# Altium project Kocka_V2.0_ARM.PrjPcb
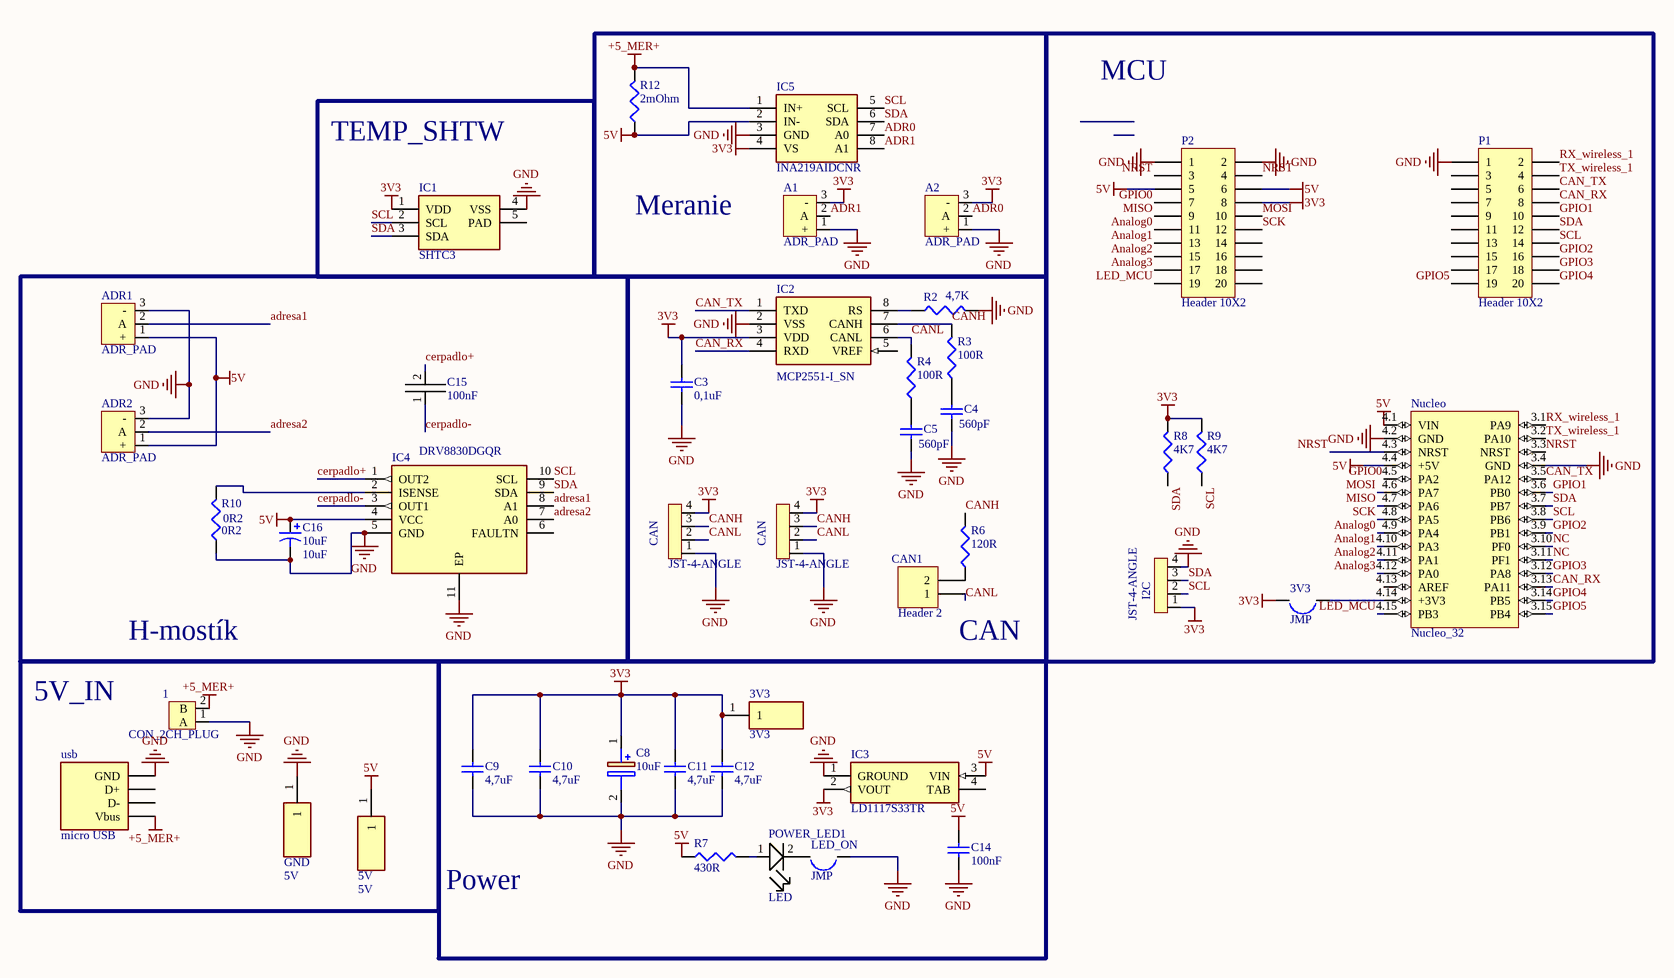
[diagram p0: Sheet_Kocka_V2.0_ARM.SchDoc]
1 sheet, 44 parts. Net scope: global (net labels, ports and power ports of the same name join across sheets).
Board files: PCB_Kocka_V2.0_ARM.PcbDoc, PCB_Kocka_panel_ARM.PcbDoc

## Sheet Sheet_Kocka_V2.0_ARM.SchDoc
size A0

### Parts
(Parts that share a designator on the sheet are numbered #1, #2 ... from top to bottom, then left to right.)
1  CON_2CH_PLUG  [CON_2CH_PLUG]
3V3#1  JMP  [JMP]
3V3#2  3V3  [1508000150000030]
5V  5V  [1508000150000030]
A1  ADR_PAD  [SOLDER_PAD]
A2  ADR_PAD  [SOLDER_PAD]
ADR1  ADR_PAD  [SOLDER_PAD]
ADR2  ADR_PAD  [SOLDER_PAD]
C3  0,1uF  [1608[0603]]
C4  560pF  [1608[0603]]
C5  560pF  [1608[0603]]
C8  10uF  [CAPPM3216X180N]
C9  4,7uF  [1608[0603]]
C10  4,7uF  [1608[0603]]
C11  4,7uF  [1608[0603]]
C12  4,7uF  [1608[0603]]
C14  100nF  [1608[0603]]
C15  100nF  [Capacitor]
C16  10uF  [C0805]
CAN1  Header 2  [HDR1X2]
CAN#1  JST-4-ANGLE  [JST-4-ANGLE]
CAN#2  JST-4-ANGLE  [JST-4-ANGLE]
GND  5V  [1508000150000030]
I2C  JST-4-ANGLE  [JST-4-ANGLE]
IC1  SHTC3  [SHTC3]
IC2  MCP2551-I_SN  [SOIC127P600X175-8N]
IC3  LD1117S33TR  [SOT230P700X180-4N]
IC4  DRV8830DGQR  [SOP50P490X110-11N]
IC5  INA219AIDCNR  [SOT65P280X145-8N]
LED_ON  JMP  [JMP]
Nucleo  Nucleo_32  [Nucleo_32]
P1  Header 10X2  [HDR2X10]
P2  Header 10X2  [HDR2X10]
POWER_LED1  LED  [LED5mA]
R2  4,7K  [J1-0603]
R3  100R  [J1-0603]
R4  100R  [J1-0603]
R6  120R  [J1-0603]
R7  430R  [J1-0603]
R8  4K7  [J1-0603]
R9  4K7  [J1-0603]
R10  0R2  [J1-0603]
R12  2mOhm  [RESC3216X75N]
usb  micro USB  [micro USB]

### Blocks framed on the sheet
Meranie: A1 A2 IC5 R12
MCU: 3V3#1 I2C Nucleo P1 P2 R8 R9
TEMP_SHTW: IC1
H-mostík: ADR1 ADR2 C15 C16 IC4 R10
CAN: C3-C5 CAN1 CAN#1 CAN#2 IC2 R2-R4 R6
Power: 3V3#2 C8-C12 C14 IC3 LED_ON POWER_LED1 R7

### Nets
3V3: 3V3#1.2 3V3#2.1 A1.3(-) A2.3(-) C3.1 C8.1(+) C9.1 C10.1 C11.1 C12.1 CAN#1.4 CAN#2.4 I2C.1 IC1.1(VDD) IC2.3(VDD) IC3.2(VOUT) IC5.4(VS) P2.8 R8.2 R9.2
5V: 5V.1 ADR1.1(+) ADR2.1(+) C14.1 C16.1 IC3.3(VIN) IC4.4(VCC) IC5.2(IN-) Nucleo.4.1(VIN) Nucleo.4.4(+5V) P2.5 P2.6 R7.1 R12.1
+5_MER+: 1.2(B) IC5.1(IN+) R12.2 usb.1(Vbus)
GND: 1.1(A) A1.1(+) A2.1(+) ADR1.3(-) ADR2.3(-) C3.2 C4.2 C5.2 C8.2(-) C9.2 C10.2 C11.2 C12.2 C14.2 C16.2 CAN#1.1 CAN#2.1 GND.1 I2C.4 IC1.4(VSS) IC2.2(VSS) IC3.1(GROUND) IC4.5(GND) IC4.11(EP) IC5.3(GND) LED_ON.1 Nucleo.3.4(GND) Nucleo.4.2(GND) P1.1 P2.1 P2.2 R2.2 R10.1 usb.5(GND)
ADR0: A2.2(A) IC5.7(A0)
ADR1: A1.2(A) IC5.8(A1)
adresa1: ADR1.2(A) IC4.8(A1)
adresa2: ADR2.2(A) IC4.7(A0)
Analog0: Nucleo.4.9(PA4) P2.11
Analog1: Nucleo.4.10(PA3) P2.13
Analog2: Nucleo.4.11(PA1) P2.15
Analog3: Nucleo.4.12(PA0) P2.17
CAN_RX: IC2.4(RXD) Nucleo.3.13(PA11) P1.8
CAN_TX: IC2.1(TXD) Nucleo.3.5(PA12) P1.6
CANH: CAN#1.3 CAN#2.3 IC2.7(CANH) R3.2 R6.2
CANL: CAN1.1 CAN#1.2 CAN#2.2 IC2.6(CANL) R4.2
cerpadlo+: C15.2 IC4.1(OUT2)
cerpadlo-: C15.1 IC4.3(OUT1)
GPIO0: Nucleo.4.5(PA2) P2.7
GPIO1: Nucleo.3.6(PB0) P1.10
GPIO2: Nucleo.3.9(PB1) P1.16
GPIO3: Nucleo.3.12(PA8) P1.18
GPIO4: Nucleo.3.14(PB5) P1.20
GPIO5: Nucleo.3.15(PB4) P1.19
LED_MCU: Nucleo.4.15(PB3) P2.19
MISO: Nucleo.4.7(PA6) P2.9
MOSI: Nucleo.4.6(PA7) P2.10
NC: Nucleo.3.10(PF0) Nucleo.3.11(PF1)
NRST: Nucleo.3.3(NRST) Nucleo.4.3(NRST) P2.3 P2.4
RX_wireless_1: Nucleo.3.1(PA9) P1.2
SCK: Nucleo.4.8(PA5) P2.12
SCL: I2C.2 IC1.2(SCL) IC4.10(SCL) IC5.5(SCL) Nucleo.3.8(PB6) P1.14 R9.1
SDA: I2C.3 IC1.3(SDA) IC4.9(SDA) IC5.6(SDA) Nucleo.3.7(PB7) P1.12 R8.1
TX_wireless_1: Nucleo.3.2(PA10) P1.4
Net3V3#1_1: 3V3#1.1 Nucleo.4.14(+3V3)
NetC4_1: C4.1 R3.1
NetC5_1: C5.1 R4.1
NetCAN1_2: CAN1.2 R6.1
NetIC2_8: IC2.8(RS) R2.1
NetIC4_2: IC4.2(ISENSE) R10.2
NetLED_ON_2: LED_ON.2 POWER_LED1.2
NetPOWER_LED1_1: POWER_LED1.1 R7.2

Not connected (* = marked no-connect by the designer): IC1 5(PAD); IC2 5(VREF); IC3 4(TAB); IC4 6(FAULTN); Nucleo 4.13(AREF); P1 3 5 7 9 11 13 15 17; P2 14 16 18 20; usb 2(D-) 3(D+)

### Notes on the sheet
- 5V_IN

### Library data of the parts
1 = CON_2CH_PLUG: TBG-5.0-KW-2P
3V3#2 5V GND = 5015: Undefined or Miscellaneous; Manufacturer_Name: Keystone Electronics; Allied_Number: 70182998; Datasheet Link: http://www.keyelco.com/product-pdf.cfm?p=1353; Height: 1.52mm; Manufacturer_Part_Number: 5015; Mouser Part Number: 534-5015; Mouser Price/Stock: https://www.mouser.com/Search/Refine.aspx?Keyword=534-5015; Allied Price/Stock: https://www.alliedelec.com/keystone-electronics-5015/70182998/
A1 A2 ADR1 ADR2 = ADR_PAD: ADR PAD 3 PIN
C3-C5 = Cap Semi: Capacitor (Semiconductor SIM Model); Value: 100pF; Published: 8-Jun-2000; LatestRevisionDate: 29-May-2009; LatestRevisionNote: IPC-7351 Footprint Added.; PackageReference: C1206; Publisher: Altium Limited; PackageDescription: Chip Capacitor
C8 = TAJA106K004RNJ: Capacitor Polarised; Manufacturer_Name: AVX; Datasheet Link: http://www.farnell.com/datasheets/1680476.pdf; Height: 1.8mm; Manufacturer_Part_Number: TAJA106K004RNJ; Mouser Part Number: 581-TAJA106K004R; Mouser Price/Stock: https://www.mouser.com/Search/Refine.aspx?Keyword=581-TAJA106K004R
C9-C12 C14 = Cap Semi: Capacitor; Value: 100pF; Published: 8-Jun-2000; LatestRevisionDate: 29-May-2009; LatestRevisionNote: IPC-7351 Footprint Added.; PackageReference: C1206; Publisher: Altium Limited; PackageDescription: Chip Capacitor
C15 = Cap
C16 = Cap Pol3: Polarized Capacitor (Surface Mount); Published: 8-Jun-2000; LatestRevisionDate: 29-May-2009; LatestRevisionNote: IPC-7351 Footprint Added.; PackageReference: C0805; Publisher: Altium Limited; PackageDescription: Chip Capacitor; Value: 10uF
CAN1 = Header 2: Header, 2-Pin; LatestRevisionDate: 17-Jul-2002; LatestRevisionNote: Re-released for DXP Platform.; Publisher: Altium Limited
CAN#1 CAN#2 I2C = JST-4-ANGLE: NXW-04K
IC1 = SHTC3: Integrated Circuit; Manufacturer_Name: Sensirion; Datasheet Link: https://www.glynshop.com/erp/owweb/Daten/Datenblaetter/Sensirion/SHTC3.pdf; Height: 0mm; Manufacturer_Part_Number: SHTC3; Mouser Part Number: 403-SHTC3; Mouser Price/Stock: https://www.mouser.com/Search/Refine.aspx?Keyword=403-SHTC3
IC2 = MCP2551-I_SN: Integrated Circuit; Manufacturer_Name: Microchip; Manufacturer_Part_Number: MCP2551-I/SN; Allied_Number: 70045403; Datasheet Link: http://docs-emea.rs-online.com/webdocs/0a78/0900766b80a78cdb.pdf; Height: 1.75mm; Mouser Part Number: 579-MCP2551-I/SN; Mouser Price/Stock: https://www.mouser.com/Search/Refine.aspx?Keyword=579-MCP2551-I%2FSN; RS Part Number: 0402904P; RS Price/Stock: http://uk.rs-online.com/web/p/products/0402904P; Allied Price/Stock: http://www.alliedelec.com/microchip-technology-inc-mcp2551-i-sn/70045403/
IC3 = LD1117S33TR: Integrated Circuit; Manufacturer_Name: STMicroelectronics; Allied_Number: 70390201; Datasheet Link: http://www.st.com/st-web-ui/static/active/en/resource/technical/document/datasheet/CD00000544.pdf; Height: 1.8mm; Manufacturer_Part_Number: LD1117S33TR; Mouser Part Number: 511-LD1117S33; Mouser Price/Stock: https://www.mouser.com/Search/Refine.aspx?Keyword=511-LD1117S33; RS Part Number: 7140697P; RS Price/Stock: http://uk.rs-online.com/web/p/products/7140697P; Allied Price/Stock: http://www.alliedelec.com/stmicroelectronics-ld1117s33tr/70390201/
IC4 = DRV8830DGQR: Integrated Circuit; Manufacturer_Name: Texas Instruments; Datasheet Link: http://www.ti.com/lit/ds/symlink/drv8830.pdf; Height: 1.1mm; Manufacturer_Part_Number: DRV8830DGQR; Mouser Part Number: 595-DRV8830DGQR; Mouser Price/Stock: https://www.mouser.com/Search/Refine.aspx?Keyword=595-DRV8830DGQR; RS Part Number: 1626149; RS Price/Stock: http://uk.rs-online.com/web/p/products/1626149
IC5 = INA219BIDCNR: Integrated Circuit; Manufacturer_Name: Texas Instruments; Datasheet Link: http://www.ti.com/lit/ds/symlink/ina219.pdf; Height: 1.45mm; Manufacturer_Part_Number: INA219BIDCNR; Mouser Part Number: 595-INA219BIDCNR; Mouser Price/Stock: https://www.mouser.com/Search/Refine.aspx?Keyword=595-INA219BIDCNR
P1 P2 = Header 10X2: Header, 10-Pin, Dual row; LatestRevisionDate: 17-Jul-2002; LatestRevisionNote: Re-released for DXP Platform.; Publisher: Altium Limited
R2-R4 R6 = Res3: Resistor; Value: 3,3k; Published: 8-Jun-2000; LatestRevisionDate: 29-May-2009; LatestRevisionNote: IPC-7351 Footprint Added.; PackageReference: J1-0603; Publisher: Altium Limited; PackageDescription: Chip Resistor
R7 R10 R12 = Res3: Resistor; Published: 8-Jun-2000; LatestRevisionDate: 29-May-2009; LatestRevisionNote: IPC-7351 Footprint Added.; PackageReference: J1-0603; Publisher: Altium Limited; PackageDescription: Chip Resistor
  R7: Value: 430R
  R10: Value: 0R2
  R12: Value: 2mOhm
R8 R9 = Res3: Resistor; Value: 1K5; Published: 8-Jun-2000; LatestRevisionDate: 29-May-2009; LatestRevisionNote: IPC-7351 Footprint Added.; PackageReference: J1-0603; Publisher: Altium Limited; PackageDescription: Chip Resistor